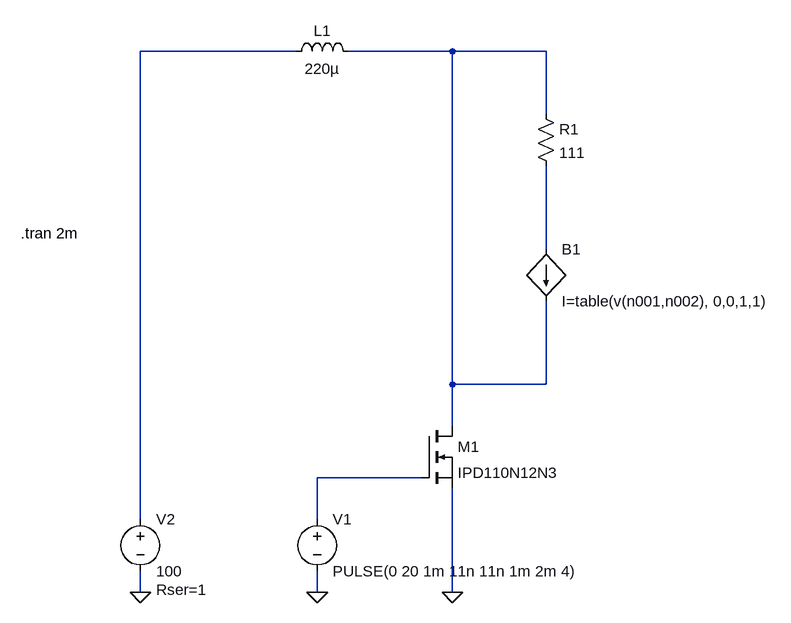
[diagram p0: schematic spark-modelling.asc]
spark-modelling.asc, the LTspice schematic file:
Version 4
SHEET 1 880 740
WIRE -16 -112 -256 -112
WIRE 224 -112 64 -112
WIRE 368 -112 224 -112
WIRE 368 -16 368 -112
WIRE 368 192 368 64
WIRE 224 400 224 -112
WIRE 368 400 368 272
WIRE 368 400 224 400
WIRE 224 464 224 400
WIRE 176 544 16 544
WIRE -256 608 -256 -112
WIRE 16 608 16 544
WIRE -256 720 -256 688
WIRE 16 720 16 688
WIRE 224 720 224 560
FLAG 224 720 0
FLAG 16 720 0
FLAG -256 720 0
SYMBOL ind -32 -96 R270
WINDOW 0 32 56 VTop 2
WINDOW 3 5 56 VBottom 2
SYMATTR InstName L1
SYMATTR Value 220µ
SYMBOL nmos 176 464 R0
SYMATTR InstName M1
SYMATTR Value IPD110N12N3
SYMBOL voltage 16 592 R0
WINDOW 123 0 0 Left 2
WINDOW 39 0 0 Left 2
SYMATTR InstName V1
SYMATTR Value PULSE(0 20 1m 11n 11n 1m 2m 4)
SYMBOL voltage -256 592 R0
WINDOW 123 0 0 Left 2
WINDOW 39 24 124 Left 2
SYMATTR InstName V2
SYMATTR Value 100
SYMATTR SpiceLine Rser=1
SYMBOL bi 368 192 R0
SYMATTR InstName B1
SYMATTR Value I=table(v(n001,n002), 0,0,1,1)
SYMBOL res 352 -32 R0
SYMATTR InstName R1
SYMATTR Value 111
TEXT -440 168 Left 2 !.tran 2m

The netlist it stands for:
* spark-modelling.asc
L1 N001 N002 220µ
M1 N002 N004 0 0 IPD110N12N3
V1 N004 0 PULSE(0 20 1m 11n 11n 1m 2m 4)
V2 N001 0 100 Rser=1
B1 N003 N002 I=table(v(n001,n002), 0,0,1,1)
R1 N002 N003 111
.model NMOS NMOS
.model PMOS PMOS
.lib standard.mos
.tran 2m
.backanno
.end